# EAGLE design untitled (EAGLE 9.6.2)
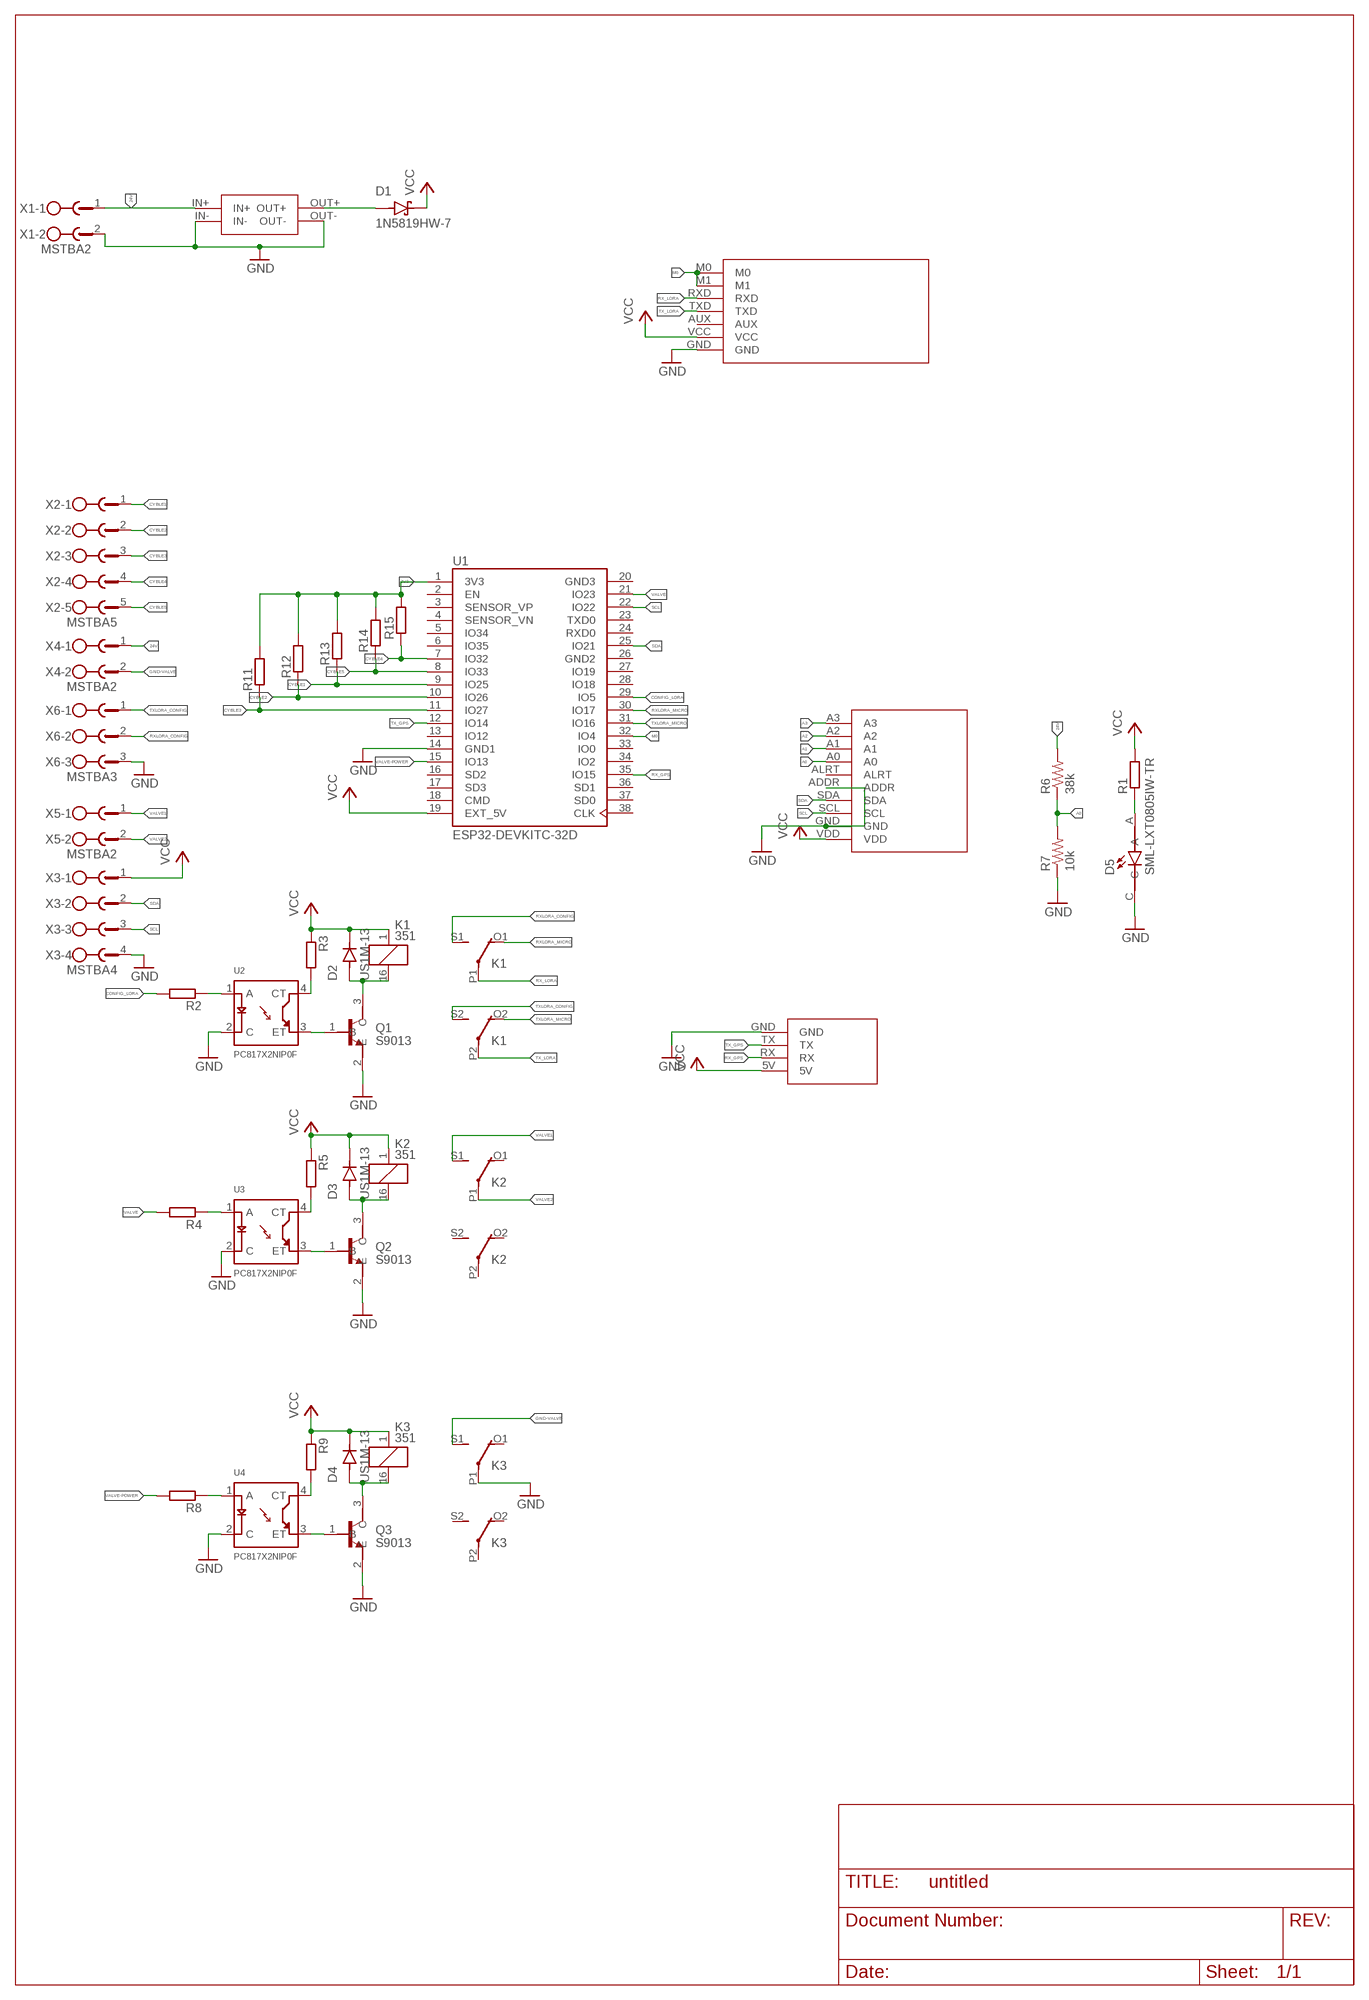
[diagram p0: schematic, sheet 1]

## Parts
ADS1  ADS1115  [ADS1115]
D1  1N5819HW-7  [SOD3715X145N]
D2  US1M-13  [DIOM5226X240N]
D3  US1M-13  [DIOM5226X240N]
D4  US1M-13  [DIOM5226X240N]
D5  SML-LXT0805IW-TR  [LEDC2012X120N]
EBYTEE220-900T22D1  EBYTEE220-900T22D  [EBYTEE220-900T22D]
K1  351  [351]
K2  351  [351]
K3  351  [351]
MINI1  MINI560  [MINI560]
NEO-6MGPS1  NEO-6MGPS  [NEO-6MGPS]
Q1  S9013  [SOT95P240X120-3N]
Q2  S9013  [SOT95P240X120-3N]
Q3  S9013  [SOT95P240X120-3N]
R1  R-EU_R0805  [R0805]
R2  R-EU_R0805  [R0805]
R3  R-EU_R0805  [R0805]
R4  R-EU_R0805  [R0805]
R5  R-EU_R0805  [R0805]
R6  38k  R-US_0207/12  [0207/12]
R7  10k  R-US_0207/12  [0207/12]
R8  R-EU_R0805  [R0805]
R9  R-EU_R0805  [R0805]
R11  R-EU_R0805  [R0805]
R12  R-EU_R0805  [R0805]
R13  R-EU_R0805  [R0805]
R14  R-EU_R0805  [R0805]
R15  R-EU_R0805  [R0805]
U1  ESP32-DEVKITC-32D  [MODULE_ESP32-DEVKITC-32D]
U2  PC817X2NIP0F  [SOT254P975X400-4N]
U3  PC817X2NIP0F  [SOT254P975X400-4N]
U4  PC817X2NIP0F  [SOT254P975X400-4N]
X1  MSTBA2  [MSTBA2]
X2  MSTBA5  [MSTBA5]
X3  MSTBA4  [MSTBA4]
X4  MSTBA2  [MSTBA2]
X5  MSTBA2  [MSTBA2]
X6  MSTBA3  [MSTBA3]

## Nets
3V3: R11.2 R12.2 R13.2 R14.2 R15.2 U1.1(3V3)
24V: MINI1.IN+ R6.2 X1.1 X4.1
A0: ADS1.A0 R6.1 R7.2
A1: ADS1.A1
A2: ADS1.A2
A3: ADS1.A3
CONFIG_LORA: R2.2 U1.29(IO5)
CYBLE1: R13.1 U1.9(IO25) X2.1
CYBLE2: R12.1 U1.10(IO26) X2.2
CYBLE3: R11.1 U1.11(IO27) X2.3
CYBLE4: R15.1 U1.7(IO32) X2.4
CYBLE5: R14.1 U1.8(IO33) X2.5
GND: ADS1.ADDR ADS1.GND D5.C EBYTEE220-900T22D1.GND K3.P1(2:P) MINI1.IN- MINI1.OUT- NEO-6MGPS1.GND Q1.2(E) Q2.2(E) Q3.2(E) R7.1 U1.14(GND1) U2.2(C) U3.2(C) U4.2(C) X1.2 X3.4 X6.3
GND-VALVE: K3.S1(2:S) X4.2
M0: EBYTEE220-900T22D1.M0 EBYTEE220-900T22D1.M1 U1.32(IO4)
N$1: D5.A R1.1
N$2: R2.1 U2.1(A)
N$3: D1.A MINI1.OUT+
N$4: R8.1 U4.1(A)
N$5: R3.2 U2.4(CT)
N$6: D2.A K1.16 Q1.3(C)
N$7: Q1.1(B) U2.3(ET)
N$8: R9.2 U4.4(CT)
N$9: R4.1 U3.1(A)
N$10: Q2.1(B) U3.3(ET)
N$11: Q3.1(B) U4.3(ET)
N$12: R5.2 U3.4(CT)
N$13: D4.A K3.16 Q3.3(C)
N$14: D3.A K2.16 Q2.3(C)
RX_GPS: NEO-6MGPS1.RX U1.35(IO15)
RX_LORA: EBYTEE220-900T22D1.RXD K1.P1(2:P)
RXLORA_CONFIG: K1.S1(2:S) X6.2
RXLORA_MICRO: K1.O1(2:O) U1.30(IO17)
SCL: ADS1.SCL U1.22(IO22) X3.3
SDA: ADS1.SDA U1.25(IO21) X3.2
TX_GPS: NEO-6MGPS1.TX U1.12(IO14)
TX_LORA: EBYTEE220-900T22D1.TXD K1.P2(3:P)
TXLORA_CONFIG: K1.S2(3:S) X6.1
TXLORA_MICRO: K1.O2(3:O) U1.31(IO16)
VALVE: R4.2 U1.21(IO23)
VALVE1: K2.S1(2:S) X5.1
VALVE2: K2.P1(2:P) X5.2
VALVE-POWER: R8.2 U1.15(IO13)
VCC: ADS1.VDD D1.C(K) D2.C(K) D3.C(K) D4.C(K) EBYTEE220-900T22D1.VCC K1.1 K2.1 K3.1 NEO-6MGPS1.5V R1.2 R3.1 R5.1 R9.1 U1.19(EXT_5V) X3.1
Unconnected: ADS1.ALRT EBYTEE220-900T22D1.AUX K2.O1(2:O) K2.O2(3:O) K2.P2(3:P) K2.S2(3:S) K3.O1(2:O) K3.O2(3:O) K3.P2(3:P) K3.S2(3:S) U1.2(EN) U1.3(SENSOR_VP) U1.4(SENSOR_VN) U1.5(IO34) U1.6(IO35) U1.13(IO12) U1.16(SD2) U1.17(SD3) U1.18(CMD) U1.23(TXD0) U1.24(RXD0) U1.27(IO19) U1.28(IO18) U1.33(IO0) U1.34(IO2) U1.36(SD1) U1.37(SD0) U1.38(CLK)

## Power pins joined to a net without a drawn wire
GND2: U1.26(GND2)
GND3: U1.20(GND3)

## Library data of the parts
ADS1 = ds1115:ADS1115
D1 = 1N5819HW-7:1N5819HW-7: 1N5819HW Series 40 V 1 A Surface Mount Schottky Barrier Rectifier - SOD-123 Check availability <https://pricing.snapeda.com/parts/1N5819HW-7/Diodes%20Inc./view-part?ref=eda>; AVAILABILITY: In Stock; DESCRIPTION: Diode Schottky 40 V 1A Surface Mount SOD-123; MF: Diodes Inc.; MP: 1N5819HW-7; PACKAGE: SOD-123 Fairchild Semiconductor; PRICE: None; PURCHASE-URL: https://pricing.snapeda.com/search/part/1N5819HW-7/?ref=eda
D2-D4 = US1M-13:US1M-13: Diode, Fast Recovery, 1a, 1kv, Do-214ac-2, Full Reel Check availability <https://pricing.snapeda.com/parts/US1M-13/Diodes%20Incorporated/view-part?ref=eda>; AVAILABILITY: In Stock; DESCRIPTION: Diode Standard 1000 V 1A Surface Mount SMA; MF: Diodes Incorporated; MP: US1M-13; PACKAGE: DO-214AC-214 Diodes Incorporated; PRICE: None; PURCHASE-URL: https://pricing.snapeda.com/search/part/US1M-13/?ref=eda
D5 = SML-LXT0805IW-TR:SML-LXT0805IW-TR: LED; Luminous Intensity:11µcd; Viewing Angle:140°; Forward Current:30mA; Forward Voltage:2V; Color:Red; LED Color:Red; Leaded Process Compatible:Yes; Lens Color:White; Mounting Type:Surface Mount ;RoHS Compliant: Yes Check availability <https://pricing.snapeda.com/parts/SML-LXT0805IW-TR/Lumex%20Opto/Components/view-part?ref=eda>; AVAILABILITY: In Stock; DESCRIPTION: Red - LED Indication - Discrete 2V 0805 (2012 Metric); MF: Lumex Opto/Components; MP: SML-LXT0805IW-TR; PACKAGE: 0805 Lumex; PRICE: None; PURCHASE-URL: https://pricing.snapeda.com/search/part/SML-LXT0805IW-TR/?ref=eda
EBYTEE220-900T22D1 = EByte E220-900T22D:EBYTEE220-900T22D
K1-K3 = relay:351: RELAY 2 x switch, Omron; OC_FARNELL: unknown; OC_NEWARK: unknown
MINI1 = MINI560:MINI560
NEO-6MGPS1 = NEO-6M GPS:NEO-6MGPS
Q1-Q3 = S9013:S9013: SMD Transistors NPN 25V-500mA Check availability <https://pricing.snapeda.com/parts/S9013/JCET/view-part?ref=eda>; AVAILABILITY: In Stock; DESCRIPTION: Bipolar (BJT) Transistor NPN 20V 500mA 625mW Through Hole TO-92-3; MF: JCET; MP: S9013; PACKAGE: SOT-23-3 JCET; PRICE: None; PURCHASE-URL: https://pricing.snapeda.com/search/part/S9013/?ref=eda
R1-R5 R8 R9 R11-R15 = rcl:R-EU_: RESISTOR, European symbol; SPICEPREFIX: R
R6 R7 = adafruit:R-US_: RESISTOR, American symbol
U1 = ESP32-DEVKITC-32D:ESP32-DEVKITC-32D: Eval Board For Esp-Wroom-32 Check availability <https://pricing.snapeda.com/parts/ESP32-DEVKITC-32D/Espressif%20Systems/view-part?ref=eda>; AVAILABILITY: In Stock; DESCRIPTION: WiFi Development Tools (802.11) ESP32 General Development Kit, ESP32-WROOM-32D on the board; MF: Espressif Systems; MP: ESP32-DEVKITC-32D; PACKAGE: None; PRICE: None; PURCHASE-URL: https://pricing.snapeda.com/search/part/ESP32-DEVKITC-32D/?ref=eda
U2-U4 = PC817X2NIP0F:PC817X2NIP0F: PC817 Series 1 Channel 80 V 5000 Vrms General Purpose Photocoupler - DIP-4 Check availability <https://pricing.snapeda.com/parts/PC817X2NIP0F/Sharp%20Microelectronics/view-part?ref=eda>; AVAILABILITY: Not in stock; DESCRIPTION: Optoisolator Transistor Output 5000Vrms 1 Channel 4-SMD; MF: Sharp Microelectronics; MP: PC817X2NIP0F; PACKAGE: SMD-4 Sharp Microelectronics; PRICE: None
X1 X4 X5 = con-phoenix-508:MSTBA2: PHOENIX; MF: FARNELL; MPN: 1757242; OC_FARNELL: 3705171; OC_NEWARK: 71C4161
X2 = con-phoenix-508:MSTBA5: PHOENIX; MPN: 1757271; OC_FARNELL: 3705201; OC_NEWARK: 71C4164
X3 = con-phoenix-508:MSTBA4: PHOENIX; MF: FARNELL; MPN: 1757268; OC_FARNELL: 3705195; OC_NEWARK: 71C4163
X6 = con-phoenix-508:MSTBA3: PHOENIX; MF: FARNELL; MPN: 1757255; OC_FARNELL: 3705183; OC_NEWARK: 71C4162

## Board
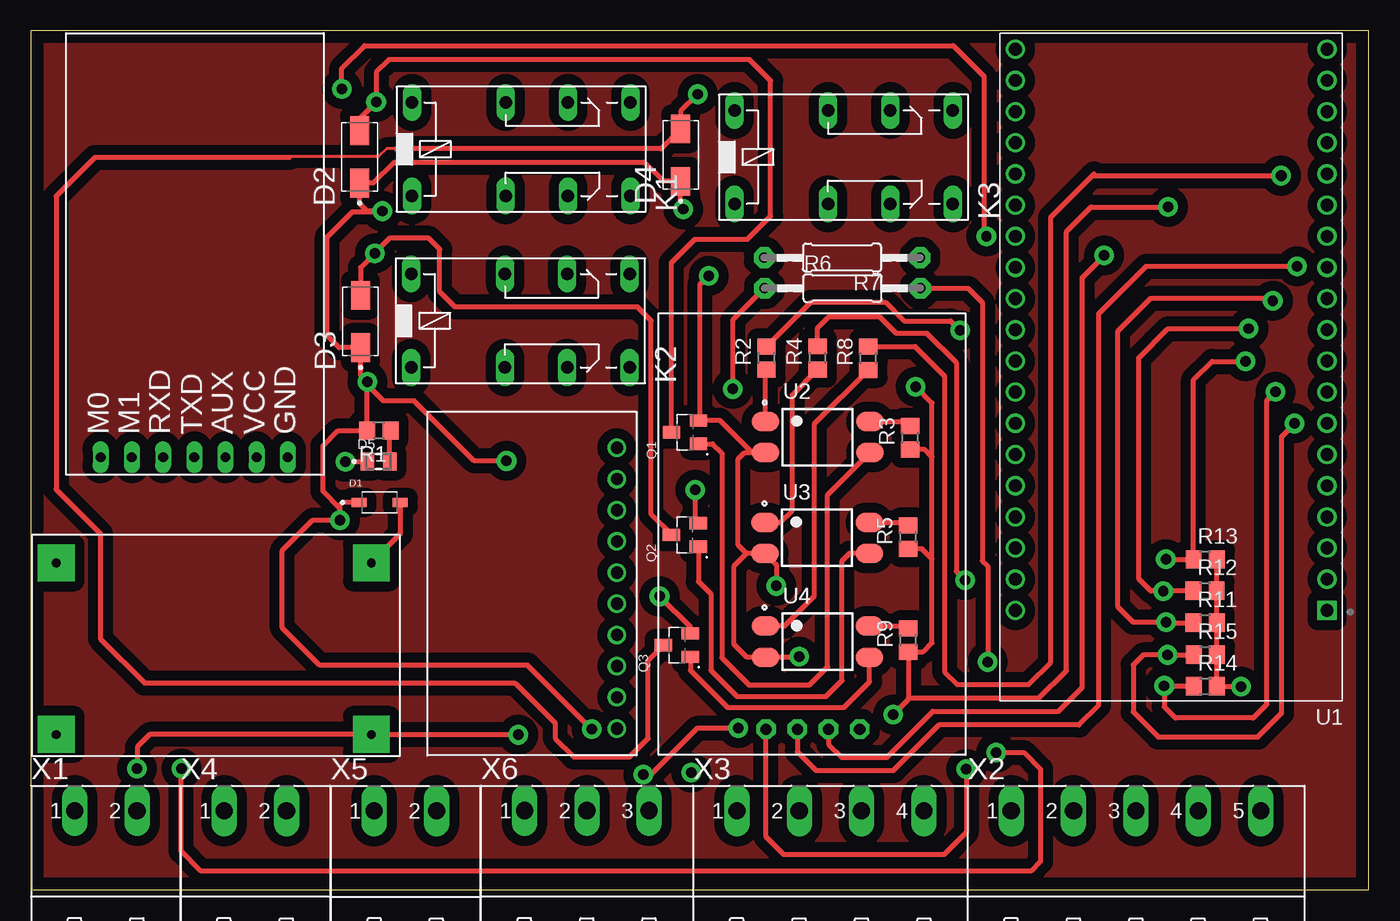
[diagram p1: board, top side]
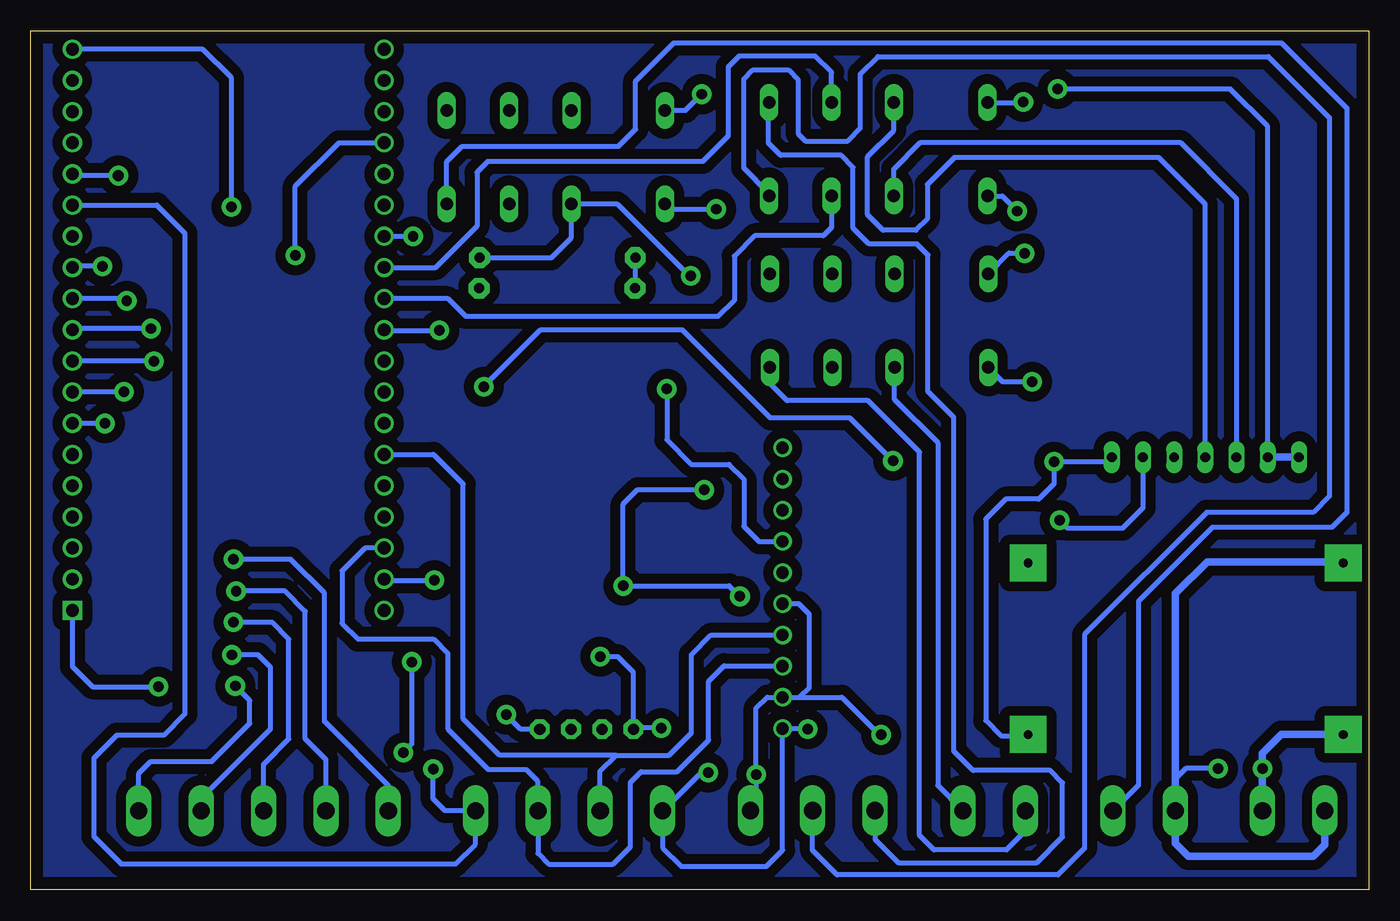
[diagram p2: board, bottom side, seen from below]

Size 109 x 70 mm. Coordinates in mm from the lower left corner, seen from the top.
Outline: 0,0 109,0 109,70 0,70 0,0
Copper layers (1*16): Top 0.035mm / dielectric 1.5mm / Bottom 0.035mm
Design rules "default": minimum track width 6mil, minimum drill 0.35mm, track to track 6mil, track to pad 6mil, pad to pad 6mil, via to via 6mil, smd to smd 6mil, copper to edge 40mil, drill to drill 6mil, minimum pad ring 10mil, minimum via ring 8mil, stop-mask expansion 4mil, vias tented up to drill 0mil, thermal gap 10mil

### Footprints (pad centres in the part's own frame; a part is rotated, then mirrored left to right if it is on the bottom)
ADS1115 = drill 1: A0 -6.35,-1.27; A1 -6.35,-3.81; A2 -6.35,-6.35; A3 -6.35,-8.89; ADDR -6.35,3.81; ALRT -6.35,1.27; GND -6.35,11.43; SCL -6.35,8.89; SDA -6.35,6.35; VDD -6.35,13.97
SOD3715X145N = smd 1.21 x 0.73: A 1.68,0; C -1.68,0
DIOM5226X240N = smd 2.33 x 1.55: A 2.135,0; C -2.135,0
LEDC2012X120N = smd 1.1 x 1.45: A 0.9,0; C -0.9,0
EBYTEE220-900T22D = drill 0.8 pad 1.27 long: AUX -4.56,-10.98; GND -4.56,-16.06; M0 -4.56,-0.82; M1 -4.56,-3.36; RXD -4.56,-5.9; TXD -4.56,-8.44; VCC -4.56,-13.52
351 = drill 1.016 long: 1 -3.81,-3.81; 16 -3.81,3.81; O1 8.89,-3.81; O2 8.89,3.81; P1 3.81,-3.81; P2 3.81,3.81; S1 13.97,-3.81; S2 13.97,3.81
MINI560 = drill 0.7 pad 3 square: IN+ 0,-1.27; IN- 0,-15.24; OUT+ 25.67,-1.27; OUT- 25.67,-15.24
NEO-6MGPS = drill 0.9 pad 1.6 octagon: 5V -8.89,7.62; GND -8.89,15.24; RX -8.89,10.16; TX -8.89,12.7
SOT95P240X120-3N = smd 1 x 1.4: 1 -0.95,-1.1; 2 0.95,-1.1; 3 0,1.1
R0805 = smd 1.3 x 1.5: 1 -0.95,0; 2 0.95,0
0207/12 = drill 0.813 pad 1.676 octagon: 1 -6.35,0; 2 6.35,0
MODULE_ESP32-DEVKITC-32D = drill 1.04 square: 1 -12.7,19.76 | drill 1.04: 2 -12.7,17.22; 3 -12.7,14.68; 4 -12.7,12.14; 5 -12.7,9.6; 6 -12.7,7.06; 7 -12.7,4.52; 8 -12.7,1.98; 9 -12.7,-0.56; 10 -12.7,-3.1; 11 -12.7,-5.64; 12 -12.7,-8.18; 13 -12.7,-10.72; 14 -12.7,-13.26; 15 -12.7,-15.8; 16 -12.7,-18.34; 17 -12.7,-20.88; 18 -12.7,-23.42; 19 -12.7,-25.96; 20 12.7,19.76; 21 12.7,17.22; 22 12.7,14.68; 23 12.7,12.14; 24 12.7,9.6; 25 12.7,7.06; 26 12.7,4.52; 27 12.7,1.98; 28 12.7,-0.56; 29 12.7,-3.1; 30 12.7,-5.64; 31 12.7,-8.18; 32 12.7,-10.72; 33 12.7,-13.26; 34 12.7,-15.8; 35 12.7,-18.34; 36 12.7,-20.88; 37 12.7,-23.42; 38 12.7,-25.96
SOT254P975X400-4N = smd 2.25 x 1.6: 1 -4.25,1.27; 2 -4.25,-1.27; 3 4.25,-1.27; 4 4.25,1.27
MSTBA2 = drill 1.397 long: 1 -2.54,5.08; 2 2.54,5.08
MSTBA5 = drill 1.397 long: 1 -10.16,5.08; 2 -5.08,5.08; 3 0,5.08; 4 5.08,5.08; 5 10.16,5.08
MSTBA4 = drill 1.397 long: 1 -7.62,5.08; 2 -2.54,5.08; 3 2.54,5.08; 4 7.62,5.08
MSTBA3 = drill 1.397 long: 1 -5.08,5.08; 2 0,5.08; 3 5.08,5.08

### Placement (x,y rotation side)
ADS1  41.41,27.12 180 top
D1  28.42,31.57 0 top
D2  26.79,59.71 90 top
D3  26.86,46.32 90 top
D4  52.95,59.87 90 top
D5  28.34,34.91 0 top
EBYTEE220-900T22D1  4.88,39.81 90 top
K1  34.87,60.34 0 top
K2  34.82,46.37 0 top
K3  61.14,59.7 0 top
MINI1  2.08,27.9 0 top
NEO-6MGPS1  75.15,21.99 90 top
Q1  53.3,37.29 90 top
Q2  53.28,28.92 90 top
Q3  52.63,19.94 90 top
R1  28.36,37.42 180 top
R2  59.94,43.33 90 top
R3  71.64,36.82 90 top
R4  64.1,43.34 90 top
R5  71.48,28.73 90 top
R6  66.13,49.02 0 top
R7  66.09,51.51 180 top
R8  68.23,43.31 90 top
R9  71.49,20.34 90 top
R11  95.65,21.76 0 top
R12  95.65,24.38 0 top
R13  95.67,26.92 0 top
R14  95.68,16.59 0 top
R15  95.68,19.16 0 top
U1  92.9,42.53 180 top
U2  64.09,36.89 0 top
U3  64.06,28.67 0 top
U4  64.09,20.23 0 top
X1  6.12,1.37 0 top
X2  90.03,1.37 0 top
X3  65.14,1.37 0 top
X4  18.29,1.37 0 top
X5  30.52,1.36 0 top
X6  45.3,1.38 0 top

### Tracks (layer width: path | path; a pad name or v marks a point on that pad's centre or on a via)
3V3  (via drill 0.85 pad 1.6)
  Top 0.406: R13.2 96.6,26.9 R12.2 R11.2 96.63,21.73 R15.2 R14.2 96.67,16.55 v98.6,16.55
  Bottom 0.406: U1.1 105.6,18.2 103.96,16.55 v98.6,16.55
24V  (via drill 0.85 pad 1.6)
  Top 0.406: R6.2 76.36,49.02 77.52,47.86 77.52,26.81 77.95,26.37 v77.95,18.57 | v78.64,11.19 80.9,11.19 82.25,9.84 82.25,2.33 81.46,1.53 13.89,1.53 12.25,3.18 12.25,9.86 v12.27,9.89
  Bottom 0.406: v77.95,18.57 77.95,11.88 v78.64,11.19 | v12.27,9.89 14.9,9.89 15.75,9.04
  Bottom 0.61: X1.1 3.58,3.69 4.53,2.75 14.7,2.75 15.75,3.8 X4.1 15.75,9.04 15.75,24.14 13.17,26.72 2.17,26.72 MINI1.IN+
A0  (via drill 0.85 pad 1.6)
  Top 0.406: R6.1 57.17,46.42 v57.17,40.81
  Bottom 0.406: R7.2 59.78,51.47 R6.1 | v57.17,40.81 57.17,36.65 55.2,34.68 52.11,34.68 50.9,33.47 50.9,29.61 49.66,28.37 47.78,28.37 ADS1.A0
CONFIG_LORA  (via drill 0.85 pad 1.6)
  Top 0.406: R2.2 63.54,47.89 69.62,47.89 71.15,46.36 74.92,46.36 v75.7,45.58
  Bottom 0.406: U1.29 80.16,45.58 v75.7,45.58
CYBLE1  (via drill 0.85 pad 1.6)
  Top 0.406: v92.47,26.93 R13.1 94.72,41.56 96.21,43.05 v98.95,43.05
  Bottom 0.406: X2.1 79.87,8.52 85.06,13.71 85.06,24.19 87.81,26.93 v92.47,26.93 | v98.95,43.05 98.99,43.09 U1.9
CYBLE2  (via drill 0.85 pad 1.6)
  Top 0.406: R12.1 92.29,24.38 v92.26,24.34 91.26,24.34 90.26,25.34 90.26,43.34 92.65,45.73 v99.21,45.73
  Bottom 0.406: X2.2 84.95,10.61 86.64,12.3 86.64,22.7 88.29,24.34 v92.26,24.34 | v99.21,45.73 105.5,45.73 U1.10
CYBLE3  (via drill 0.85 pad 1.6)
  Top 0.406: R11.1 92.54,21.76 v92.49,21.81 89.81,21.81 88.57,23.05 88.57,45.53 91.23,48.2 100.98,48.2 v101.18,48
  Bottom 0.406: X2.3 90.03,10.23 87.97,12.28 87.97,20.44 89.3,21.77 92.49,21.77 v92.49,21.81 | v101.18,48 101.35,48.17 U1.11
CYBLE4  (via drill 0.85 pad 1.6)
  Top 0.406: R15.1 92.64,19.16 v92.62,19.14 90.62,19.14 89.81,18.34 89.81,14.49 91.85,12.46 99.96,12.46 101.91,14.4 101.91,36.95 v102.96,38
  Bottom 0.406: X2.4 95.11,7.46 89.46,13.11 89.46,18.14 90.48,19.16 92.6,19.16 v92.62,19.14 | v102.96,38 102.97,38.01 U1.7
CYBLE5  (via drill 0.85 pad 1.6)
  Top 0.406: R14.1 94.71,16.62 v92.34,16.62 92.34,14.92 93.25,14 99.59,14 100.7,15.12 100.7,39.87 v101.4,40.57
  Bottom 0.406: X2.5 100.19,9.49 99.22,10.46 94.25,10.46 91.15,13.56 91.15,15.44 v92.34,16.62 | v101.4,40.57 105.59,40.57 U1.8
GND  (via drill 0.85 pad 1.6)
  Top 0.406: U2.2 58.76,35.62 | 58.76,35.62 56.14,38.24 Q1.2 54.5,38.24 54.5,49.31 v55.23,50.04 | 58.32,27.4 U3.2 60.74,26.47 v60.74,24.77 | 58.32,27.4 57.62,28.1 57.62,35.1 58.14,35.62 58.76,35.62 | 58.32,27.4 57.31,26.39 57.31,19.99 58.34,18.96 U4.2 62.58,18.96 v62.61,18.99 | v25.64,34.87 25.67,34.91 D5.C | v54.12,32.58 54.12,30.12 Q2.2 | v49.91,9.38 50.5,9.38 54.26,13.15 57.59,13.15 v57.63,13.18 | v51.23,23.91 53.73,21.41 Q3.2 | v39.72,12.63 27.78,12.63 MINI1.OUT- 9.71,12.66 8.69,11.64 8.69,9.89 v8.66,9.89 | v76.22,9.83 76.22,4.69 74.4,2.87 61.35,2.87 59.91,4.31 NEO-6MGPS1.GND
  Bottom 0.406: 46.36,15.69 ADS1.GND 47.77,15.7 49.01,15.7 49.91,14.81 v49.91,9.38 49.91,6.93 X6.3 | 46.36,15.69 45.58,16.46 45.58,22.46 46.43,23.31 ADS1.ADDR | EBYTEE220-900T22D1.GND 21.32,34.87 v25.64,34.87 | v25.64,34.87 | R7.1 66.58,51.51 64.95,53.14 K3.P1 61.25,55.89 55.39,50.04 v55.23,50.04 | v62.61,18.99 61.17,18.99 59.91,17.73 NEO-6MGPS1.GND 59.82,13.18 v57.63,13.18 | v54.12,32.58 54.12,32.61 59.56,32.61 60.74,31.43 v60.74,24.77 52.1,24.77 51.25,23.91 v51.23,23.91 | U1.14 98.73,55.79 96.44,53.5 96.44,14.32 98.16,12.6 101.98,12.6 103.86,10.72 103.86,4.35 101.63,2.12 74.37,2.12 72.76,3.73 X3.4 75.25,6.45 76.22,7.41 v76.22,9.83 | 46.36,15.69 42.94,15.69 39.88,12.63 v39.72,12.63 | v25.64,34.87 25.64,33.07 26.88,31.83 29.58,31.83 31.19,30.22 31.19,13.79 29.97,12.57 27.85,12.57 MINI1.OUT-
  Bottom 0.61: X1.2 v8.66,9.89 8.66,11.13 7.12,12.66 MINI1.IN-
GND-VALVE
  Bottom 0.406: K3.S1 75.11,59.32 73.85,60.58 61.11,60.58 59.72,61.97 59.72,65.89 56.61,69.01 7.11,69.01 1.79,63.69 1.79,30.73 3,29.53 12.74,29.53 18.76,23.51 18.76,8.52 X4.2
M0  (via drill 0.85 pad 1.6)
  Top 0.406: v25.34,65.24 25.34,66.94 27.19,68.78 75.14,68.78 77.65,66.27 77.65,53.44 v77.85,53.24
  Bottom 0.406: EBYTEE220-900T22D1.M1 8.24,62.22 11.27,65.24 v25.34,65.24 | v77.85,53.24 80.19,53.24 U1.32
  Bottom 0.61: EBYTEE220-900T22D1.M0 EBYTEE220-900T22D1.M1
N$1
  Top 0.406: D5.A 29.24,37.35 R1.1
N$2
  Top 0.406: U2.1 59.84,42.29 R2.1
N$3
  Top 0.406: D1.A 30.1,28.99 MINI1.OUT+
N$4
  Top 0.406: U4.1 61.41,21.5 63.82,23.91 63.82,37.95 R8.1
N$5
  Top 0.406: U2.4 71.25,38.16 R3.2
N$6  (via drill 0.85 pad 1.6)
  Top 0.406: D2.A 26.79,62.83 v28.14,64.18 28.14,66.6 29.18,67.64 58.57,67.64 60.27,65.94 60.27,54.88 58.4,53.01 54.11,53.01 52.2,51.09 Q1.3
  Bottom 0.406: K1.16 28.17,64.15 v28.14,64.18
N$7
  Top 0.406: Q1.1 55.54,36.34 56.3,35.58 56.3,18.91 58.51,16.7 63.42,16.7 64.91,18.18 64.91,32.19 U2.3
N$8
  Top 0.406: U4.4 71.29,21.5 R9.2
N$9
  Top 0.406: U3.1 61.05,29.94 62.04,30.93 62.04,40.33 R4.1
N$10
  Top 0.406: Q2.1 54.38,25.12 55.4,24.1 55.4,17.9 57.55,15.76 64.79,15.76 66.1,17.06 66.1,26.81 66.73,27.44 68.28,27.44 U3.3
N$11
  Top 0.406: Q3.1 53.73,17.88 56.76,14.86 66.23,14.86 68.34,16.96 U4.3
N$12
  Top 0.406: U3.4 71.21,29.94 R5.2
N$13  (via drill 0.85 pad 1.6)
  Top 0.254: 29.76,60.38 28.97,60.38 28.31,59.72 21.14,59.72 21.08,59.66
  Top 0.406: v54.34,64.82 52.95,63.44 D4.A 51.33,60.38 29.76,60.38 | 21.08,59.66 5.23,59.66 2.07,56.5 2.07,32.63 5.67,29.03 5.67,20.46 9.27,16.86 39.45,16.86 42.71,13.6 42.71,12.35 44.25,10.82 48.78,10.82 50.3,12.34 50.3,18.71 Q3.3
  Bottom 0.406: K3.16 55.65,63.51 v54.34,64.82
N$14  (via drill 0.85 pad 1.6)
  Top 0.406: D3.A 26.86,50.71 v28.02,51.87 29.24,53.08 32.43,53.08 33.32,52.2 33.32,48.73 34.55,47.49 49.44,47.49 50.55,46.37 50.55,30.59 52.18,28.96 Q2.3
  Bottom 0.406: K2.16 29.3,51.88 v28.04,51.88 v28.02,51.87
N$15
  pour Top (isolate 0.813): 0.09,70.08 109.09,70.08 109.09,0.08 0.09,0.08
N$16
  pour Bottom (isolate 0.813): 0.09,70.08 109.09,70.08 109.09,0.08 0.09,0.08
RX_GPS  (via drill 0.85 pad 1.6)
  Top 0.406: NEO-6MGPS1.RX 64.99,11.86 66.06,10.78 69.73,10.78 73.49,14.55 83.72,14.55 85.65,16.48 85.65,49.9 v87.44,51.69
  Bottom 0.406: v87.44,51.69 87.44,57.31 83.89,60.87 U1.35
RX_LORA
  Bottom 0.406: K1.P1 38.68,58.74 36.52,60.9 15.37,60.9 10.78,56.32 EBYTEE220-900T22D1.RXD
RXLORA_CONFIG
  Bottom 0.406: K1.S1 48.84,56.74 50.91,58.81 50.91,66.05 50.14,66.82 47.29,66.82 46.48,66 46.48,61.62 45.87,61.01 42.45,61.01 41.41,62.05 41.41,66.48 40,67.9 8.19,67.9 3.21,62.92 3.21,32.08 4.53,30.76 13.21,30.76 23.16,20.8 23.16,3.37 25.32,1.22 43.31,1.22 45.3,3.21 X6.2
RXLORA_MICRO
  Bottom 0.406: K1.O1 43.76,53.96 44.44,53.29 50.03,53.29 51.67,51.64 51.67,48.03 52.99,46.71 73.54,46.71 75,48.17 U1.30
SCL
  Bottom 0.406: ADS1.SCL 47.8,18.26 52.51,18.26 53.78,17 53.78,12.19 56.34,9.62 59.28,9.62 60.16,8.74 60.16,3.51 61.57,2.09 66.81,2.09 67.68,2.97 X3.3 67.68,8.84 68.66,9.81 71.73,9.81 75.04,13.13 75.04,19.27 76.2,20.44 82.35,20.44 83.63,21.72 83.63,25.99 81.77,27.85 U1.22
SDA
  Bottom 0.406: X3.2 62.6,9.71 61.34,10.98 | 61.34,10.98 56.99,10.98 55.19,12.78 55.19,19.14 53.57,20.77 ADS1.SDA | 61.34,10.98 70.8,10.98 73.77,13.94 73.77,33.05 76.18,35.47 U1.25
TX_GPS  (via drill 0.85 pad 1.6)
  Top 0.406: NEO-6MGPS1.TX 62.45,11.26 63.97,9.74 70.28,9.74 73.97,13.43 85.39,13.43 87,15.04 87,46.95 90.86,50.81 v103.15,50.81
  Bottom 0.406: v103.15,50.81 105.5,50.81 U1.12
TX_LORA
  Bottom 0.406: EBYTEE220-900T22D1.TXD 13.32,55.88 17.11,59.67 33.76,59.67 35.96,57.46 35.96,54.66 36.88,53.75 39.57,53.75 40.83,55.01 40.83,59.72 38.68,61.87 K1.P2
TXLORA_CONFIG
  Bottom 0.406: X6.1 40.22,4.11 38.32,2.21 27.05,2.21 24.94,4.32 24.94,8.74 25.93,9.73 32.23,9.73 33.8,11.3 33.8,38.49 35.91,40.59 35.91,51.73 36.8,52.62 40.71,52.62 42,53.91 42,58.87 42.98,59.84 47.91,59.84 48.89,60.82 48.89,64.11 K1.S2
TXLORA_MICRO
  Bottom 0.406: K1.O2 43.76,66.6 45.1,67.93 51.3,67.93 52.19,67.04 52.19,61.42 54.27,59.34 71.79,59.34 72.65,58.47 72.65,54.07 76.01,50.71 U1.31
VALVE  (via drill 0.85 pad 1.6)
  Top 0.406: R4.2 64.1,45.78 64.98,46.66 69.18,46.66 70.51,45.34 73.01,45.34 75.39,42.97 75.39,25.96 v76.13,25.22
  Bottom 0.406: U1.21 80.09,25.2 76.15,25.2 v76.13,25.22
VALVE1
  Bottom 0.406: X5.1 27.98,4.8 29.52,3.26 35.42,3.26 36.6,4.44 36.6,35.67 40.79,39.86 47.39,39.86 48.79,41.25 K2.S1
VALVE2
  Bottom 0.406: X5.2 35.12,8.5 35.12,36.44 38.63,39.95 K2.P1
VALVE-POWER  (via drill 0.9 pad 1.6)
  Top 0.406: R8.2 72.04,44.26 74.45,41.85 74.45,17.76 75.48,16.74 81.27,16.74 83.08,18.55 83.08,54.81 86.47,58.19 | 86.47,58.19 86.61,58.33 | 86.47,58.19 v101.86,58.19 101.92,58.26
  Bottom 0.406: v101.86,58.19 105.46,58.19 U1.15
VCC  (via drill 0.85 pad 1.6)
  Top 0.406: v53.15,55.46 52.95,55.66 D4.C 51.54,57.73 50,59.27 29.6,59.27 27.91,57.58 D2.C 26.79,55.92 27.4,55.3 v28.63,55.3 28.57,55.24 26.21,55.24 24.15,53.18 24.15,45.16 25.12,44.18 D3.C 26.86,41.95 v27.42,41.4 v27.41,41.39 27.41,41.16 | 27.41,41.16 R1.2 25.06,37.42 23.8,36.16 23.8,32.49 25.18,31.11 v25.18,30.13 | 73.43,26.96 73.43,20.11 72.71,19.39 R9.1 71.49,15.63 | R5.1 72.61,27.78 73.43,26.96 | 73.43,26.96 73.43,35.28 | R3.1 72.83,35.87 73.43,35.28 | D1.C 25.43,31.57 25.18,31.31 v25.18,30.13 | v70.26,14.29 71.49,15.52 71.49,15.63 | 73.43,35.28 73.43,39.67 v72.1,40.99 | v38.76,34.95 36.13,34.95 31.25,39.83 28.74,39.83 27.41,41.16 | v45.7,13.1 40.49,18.3 23.54,18.3 20.49,21.36 20.49,27.64 22.98,30.13 v25.18,30.13 | 71.49,15.63 82.14,15.63 84.37,17.86 84.37,53.63 86.37,55.64 v92.65,55.64
  Bottom 0.406: K2.1 29.84,41.4 v27.42,41.4 | K3.1 56.9,55.46 v53.15,55.46 | EBYTEE220-900T22D1.VCC 18.4,31.12 20.07,29.45 24.51,29.45 25.18,30.11 v25.18,30.13 | K1.1 29.87,56.53 v28.63,55.3 | NEO-6MGPS1.5V 69.1,13.1 70.27,14.27 v70.26,14.29 | v72.1,40.99 67.45,45.64 55.93,45.64 48.77,38.48 42.29,38.48 v38.76,34.95 | v53.82,9.54 54.39,9.54 57.48,6.45 X3.1 57.52,3.43 56.01,1.92 49.08,1.92 47.76,3.23 ADS1.VDD 45.75,13.15 v45.7,13.1 | v92.65,55.64 92.65,66.15 94.97,68.47 105.59,68.47 U1.19